# EAGLE design InverterControl_RevA (EAGLE 7.6.0)

## Sheet 1 of 3
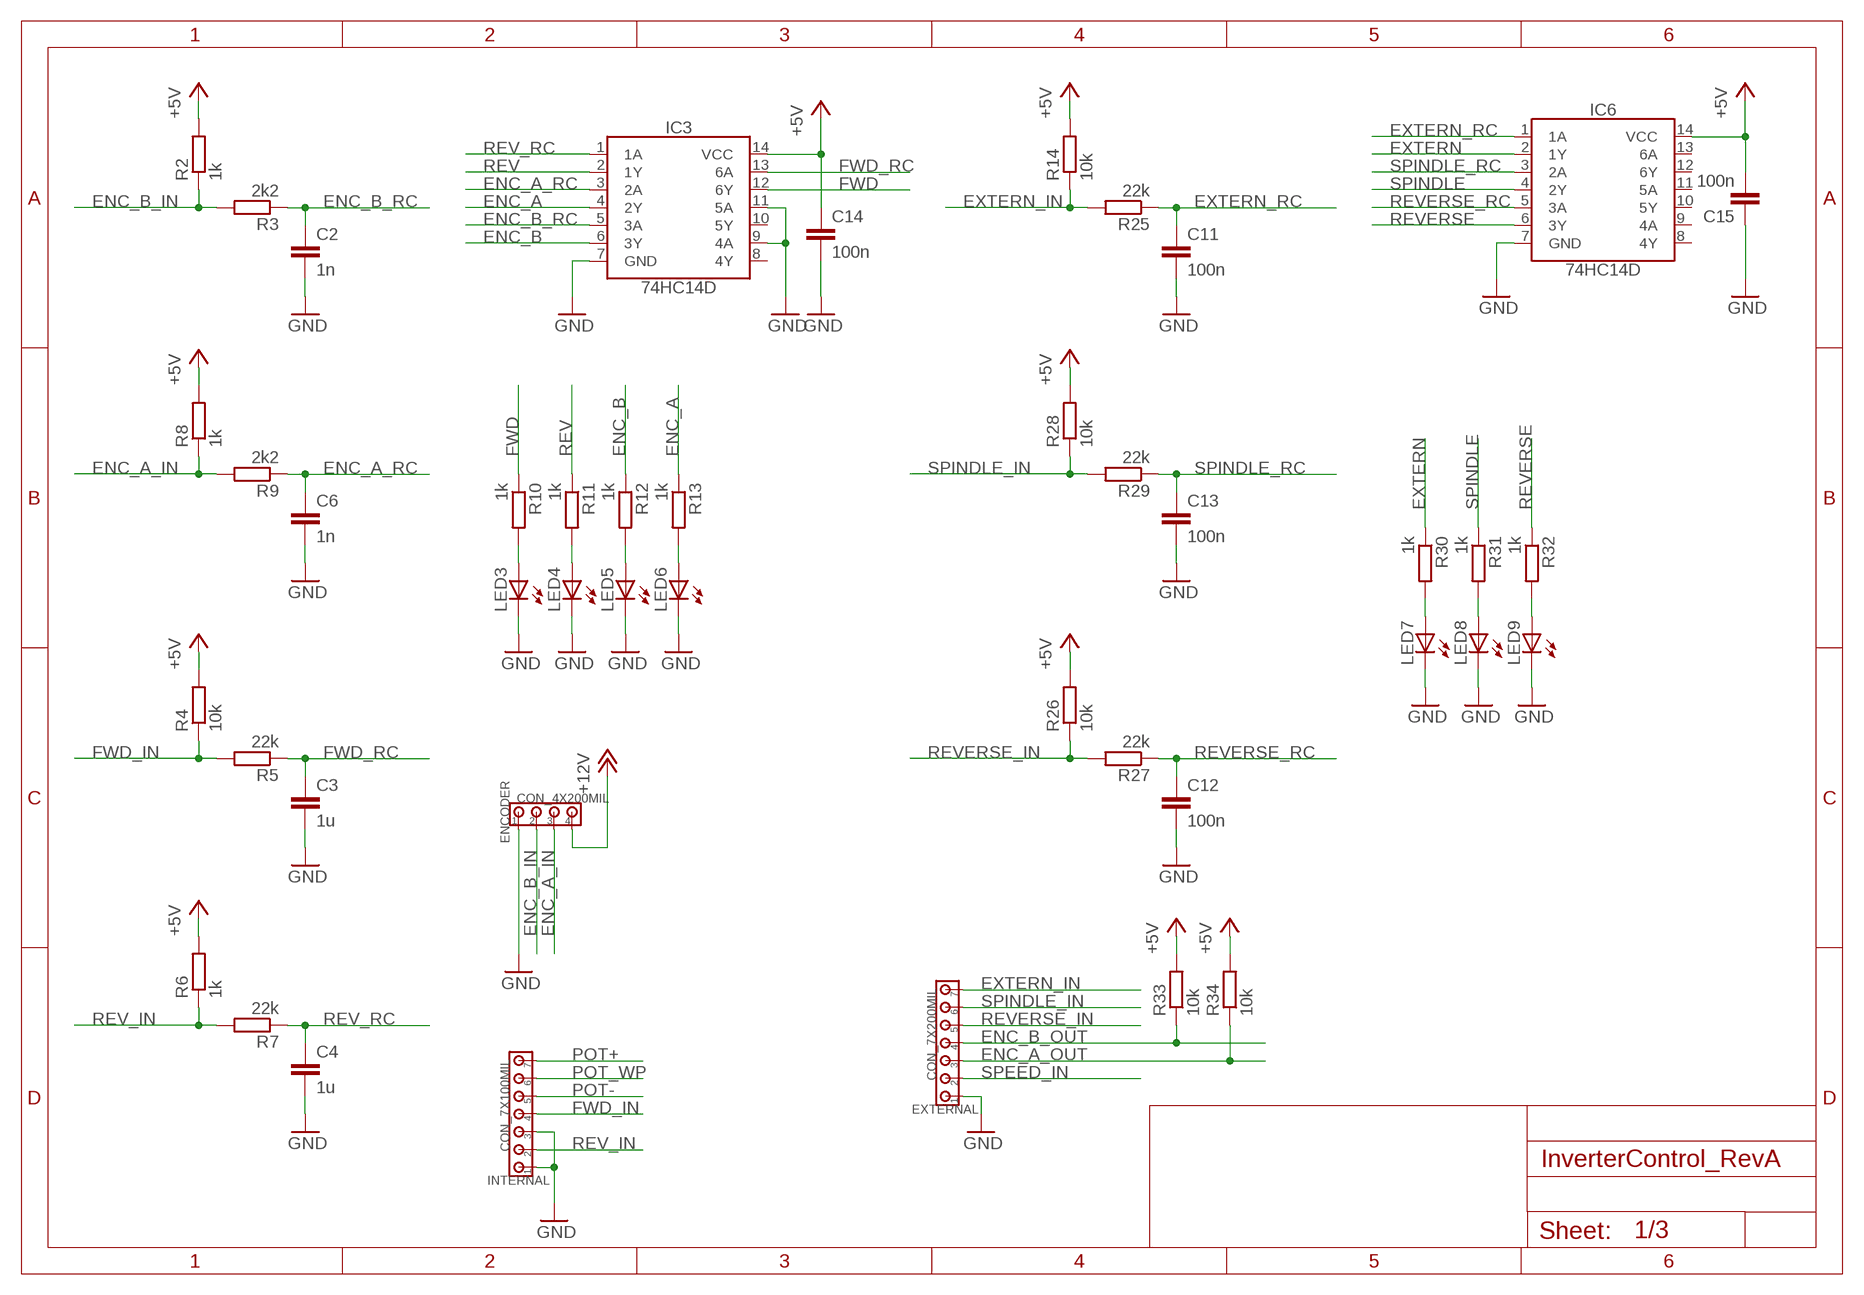
[diagram p0: schematic, sheet 1]

### Parts
C2  1n  CC0805  [C0805]
C3  1u  CC0805  [C0805]
C4  1u  CC0805  [C0805]
C6  1n  CC0805  [C0805]
C11  100n  CC0805  [C0805]
C12  100n  CC0805  [C0805]
C13  100n  CC0805  [C0805]
C14  100n  CC0805  [C0805]
C15  100n  CC0805  [C0805]
ENCODER  CON_4X200MIL  [200MIL_4X]
EXTERNAL  CON_7X200MIL  [200MIL_7X]
IC3  74HC14D  [SO14]
IC6  74HC14D  [SO14]
INTERNAL  CON_7X100MIL  [100MIL_7X]
LED3  LED0805  [LED0805]
LED4  LED0805  [LED0805]
LED5  LED0805  [LED0805]
LED6  LED0805  [LED0805]
LED7  LED0805  [LED0805]
LED8  LED0805  [LED0805]
LED9  LED0805  [LED0805]
R2  1k  RESISTORR0805  [R0805]
R3  2k2  RESISTORR0805  [R0805]
R4  10k  RESISTORR0805  [R0805]
R5  22k  RESISTORR0805  [R0805]
R6  1k  RESISTORR0805  [R0805]
R7  22k  RESISTORR0805  [R0805]
R8  1k  RESISTORR0805  [R0805]
R9  2k2  RESISTORR0805  [R0805]
R10  1k  RESISTORR0805  [R0805]
R11  1k  RESISTORR0805  [R0805]
R12  1k  RESISTORR0805  [R0805]
R13  1k  RESISTORR0805  [R0805]
R14  10k  RESISTORR0805  [R0805]
R25  22k  RESISTORR0805  [R0805]
R26  10k  RESISTORR0805  [R0805]
R27  22k  RESISTORR0805  [R0805]
R28  10k  RESISTORR0805  [R0805]
R29  22k  RESISTORR0805  [R0805]
R30  1k  RESISTORR0805  [R0805]
R31  1k  RESISTORR0805  [R0805]
R32  1k  RESISTORR0805  [R0805]
R33  10k  RESISTORR0805  [R0805]
R34  10k  RESISTORR0805  [R0805]

### Nets
+5V [+5v]: C14.1 C15.2 IC3.14(VCC) IC6.14(VCC) R2.2 R4.2 R6.2 R8.2 R14.2 R26.2 R28.2 R33.2 R34.2 ; also sheet 2,3
+12V [12v]: ENCODER.4 ; also sheet 2,3
ENC_A: IC3.4(2Y) R13.1 ; also sheet 2,3
ENC_A_IN: ENCODER.3 R8.1 R9.2
ENC_A_OUT: EXTERNAL.3 R34.1 ; also sheet 2
ENC_A_RC: C6.1 IC3.3(2A) R9.1
ENC_B: IC3.6(3Y) R12.1 ; also sheet 2,3
ENC_B_IN: ENCODER.2 R2.1 R3.2
ENC_B_OUT: EXTERNAL.4 R33.1 ; also sheet 2
ENC_B_RC: C2.1 IC3.5(3A) R3.1
EXTERN: IC6.2(1Y) R30.1 ; also sheet 3
EXTERN_IN: EXTERNAL.7 R14.1 R25.2
EXTERN_RC: C11.1 IC6.1(1A) R25.1
FWD: IC3.12(6Y) R10.1 ; also sheet 3
FWD_IN: INTERNAL.4 R4.1 R5.2
FWD_RC: C3.1 IC3.13(6A) R5.1
GND: C2.2 C3.2 C4.2 C6.2 C11.2 C12.2 C13.2 C14.2 C15.1 ENCODER.1 EXTERNAL.1 IC3.7(GND) IC3.9(4A) IC3.11(5A) IC6.7(GND) INTERNAL.1 INTERNAL.3 LED3.C LED4.C LED5.C LED6.C LED7.C LED8.C LED9.C ; also sheet 2,3
N$1: LED3.A R10.2
N$2: LED4.A R11.2
N$3: LED5.A R12.2
N$4: LED7.A R30.2
N$7: LED6.A R13.2
N$24: LED8.A R31.2
N$25: LED9.A R32.2
POT+ [analog]: INTERNAL.7 ; also sheet 2
POT- [analog]: INTERNAL.5 ; also sheet 2
POT_WP [analog]: INTERNAL.6 ; also sheet 2
REV: IC3.2(1Y) R11.1 ; also sheet 3
REV_IN: INTERNAL.2 R6.1 R7.2
REV_RC: C4.1 IC3.1(1A) R7.1
REVERSE: IC6.6(3Y) R32.1 ; also sheet 3
REVERSE_IN: EXTERNAL.5 R26.1 R27.2
REVERSE_RC: C12.1 IC6.5(3A) R27.1
SPEED_IN: EXTERNAL.2 ; also sheet 2
SPINDLE: IC6.4(2Y) R31.1 ; also sheet 3
SPINDLE_IN: EXTERNAL.6 R28.1 R29.2
SPINDLE_RC: C13.1 IC6.3(2A) R29.1
Unconnected: IC3.8(4Y) IC3.10(5Y) IC6.8(4Y) IC6.9(4A) IC6.10(5Y) IC6.11(5A) IC6.12(6Y) IC6.13(6A)

## Sheet 2 of 3
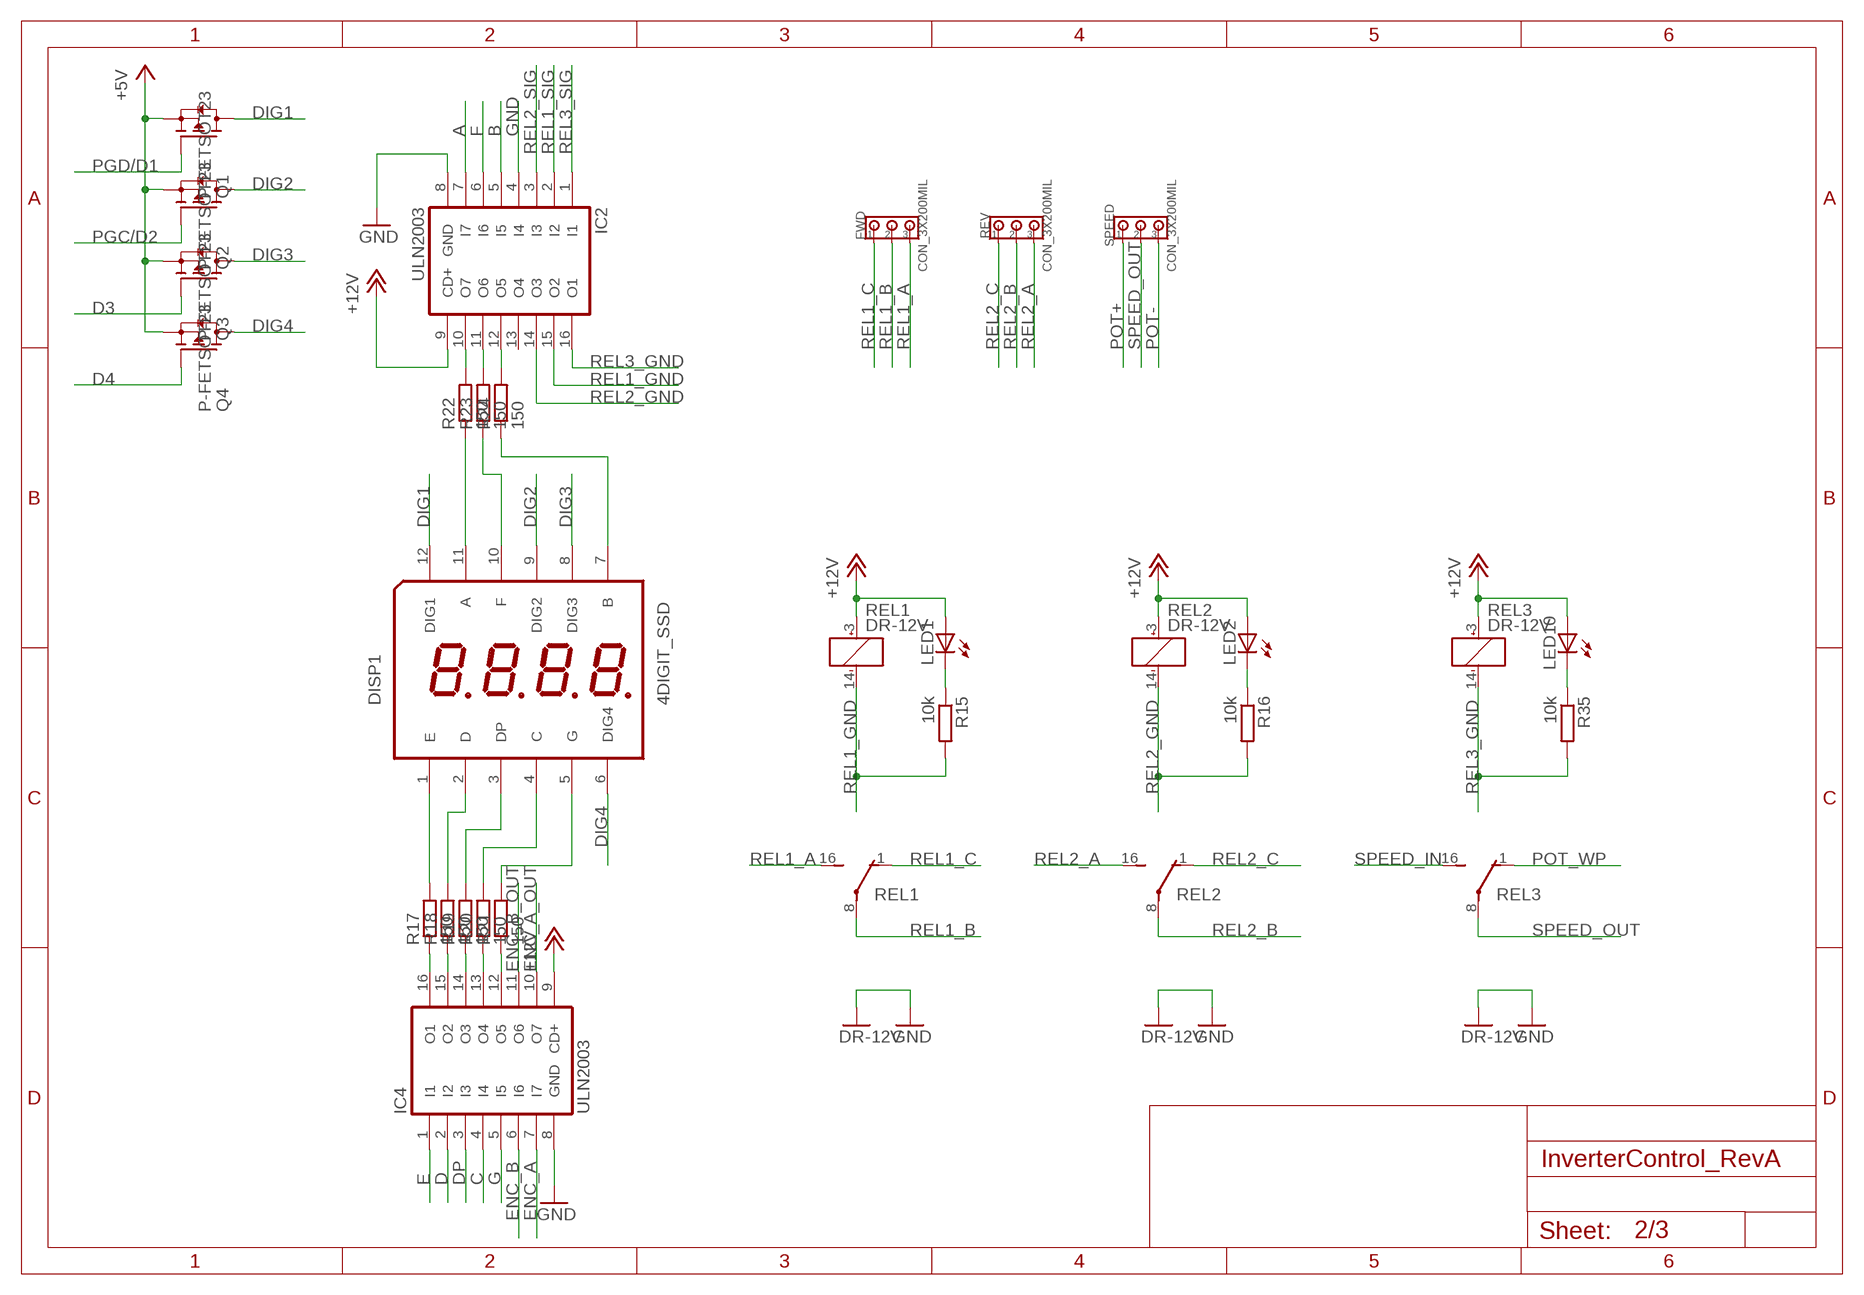
[diagram p1: schematic, sheet 2]

### Parts
DISP1  4DIGIT_SSD  [4DIGIT_SSD]
FWD  CON_3X200MIL  [200MIL_3X]
IC2  ULN2003  [SO16]
IC4  ULN2003  [SO16]
LED1  LED0805  [LED0805]
LED2  LED0805  [LED0805]
LED10  LED0805  [LED0805]
Q1  P-FETSOT23  [SOT23]
Q2  P-FETSOT23  [SOT23]
Q3  P-FETSOT23  [SOT23]
Q4  P-FETSOT23  [SOT23]
R15  10k  RESISTORR0805  [R0805]
R16  10k  RESISTORR0805  [R0805]
R17  150  RESISTORR0805  [R0805]
R18  150  RESISTORR0805  [R0805]
R19  150  RESISTORR0805  [R0805]
R20  150  RESISTORR0805  [R0805]
R21  150  RESISTORR0805  [R0805]
R22  150  RESISTORR0805  [R0805]
R23  150  RESISTORR0805  [R0805]
R24  150  RESISTORR0805  [R0805]
R35  10k  RESISTORR0805  [R0805]
REL1  DR-12V  [DR-12V]
REL2  DR-12V  [DR-12V]
REL3  DR-12V  [DR-12V]
REV  CON_3X200MIL  [200MIL_3X]
SPEED  CON_3X200MIL  [200MIL_3X]

### Nets
+5V [+5v]: Q1.2(S) Q2.2(S) Q3.2(S) Q4.2(S) ; also sheet 1,3
+12V [12v]: IC2.9(CD+) IC4.9(CD+) LED1.A LED2.A LED10.A REL1.3(+) REL2.3(+) REL3.3(+) ; also sheet 1,3
A: IC2.7(I7) ; also sheet 3
B: IC2.5(I5) ; also sheet 3
C: IC4.4(I4) ; also sheet 3
D: IC4.2(I2) ; also sheet 3
D3: Q3.1(G) ; also sheet 3
D4: Q4.1(G) ; also sheet 3
DIG1: DISP1.12(DIG1) Q1.3(D)
DIG2: DISP1.9(DIG2) Q2.3(D)
DIG3: DISP1.8(DIG3) Q3.3(D)
DIG4: DISP1.6(DIG4) Q4.3(D)
DP: IC4.3(I3) ; also sheet 3
E: IC4.1(I1) ; also sheet 3
ENC_A: IC4.7(I7) ; also sheet 1,3
ENC_A_OUT: IC4.10(O7) ; also sheet 1
ENC_B: IC4.6(I6) ; also sheet 1,3
ENC_B_OUT: IC4.11(O6) ; also sheet 1
F: IC2.6(I6) ; also sheet 3
G: IC4.5(I5) ; also sheet 3
GND: IC2.4(I4) IC2.8(GND) IC4.8(GND) REL1.9(GND) REL2.9(GND) REL3.9(GND) ; also sheet 1,3
N$5: DISP1.1(E) R17.2
N$6: DISP1.2(D) R18.2
N$8: LED1.C R15.1
N$9: LED2.C R16.1
N$10: DISP1.3(DP) R19.2
N$11: DISP1.4(C) R20.2
N$12: DISP1.5(G) R21.2
N$13: DISP1.11(A) R22.1
N$14: DISP1.10(F) R23.1
N$15: DISP1.7(B) R24.1
N$16: IC4.16(O1) R17.1
N$17: IC4.15(O2) R18.1
N$18: IC4.14(O3) R19.1
N$19: IC4.13(O4) R20.1
N$20: IC4.12(O5) R21.1
N$21: IC2.10(O7) R22.2
N$22: IC2.11(O6) R23.2
N$23: IC2.12(O5) R24.2
N$26: LED10.C R35.1
PGC/D2: Q2.1(G) ; also sheet 3
PGD/D1: Q1.1(G) ; also sheet 3
POT+ [analog]: SPEED.1 ; also sheet 1
POT- [analog]: SPEED.3 ; also sheet 1
POT_WP [analog]: REL3.1(NC) ; also sheet 1
REL1_A [relay]: FWD.3 REL1.16(NO)
REL1_B [relay]: FWD.2 REL1.8(COM)
REL1_C [relay]: FWD.1 REL1.1(NC)
REL1_GND: IC2.15(O2) R15.2 REL1.14(-)
REL1_SIG: IC2.2(I2) ; also sheet 3
REL2_A [relay]: REL2.16(NO) REV.3
REL2_B [relay]: REL2.8(COM) REV.2
REL2_C [relay]: REL2.1(NC) REV.1
REL2_GND: IC2.14(O3) R16.2 REL2.14(-)
REL2_SIG: IC2.3(I3) ; also sheet 3
REL3_GND: IC2.16(O1) R35.2 REL3.14(-)
REL3_SIG: IC2.1(I1) ; also sheet 3
SPEED_IN: REL3.16(NO) ; also sheet 1
SPEED_OUT [analog]: REL3.8(COM) SPEED.2
Unconnected: IC2.13(O4)

## Sheet 3 of 3
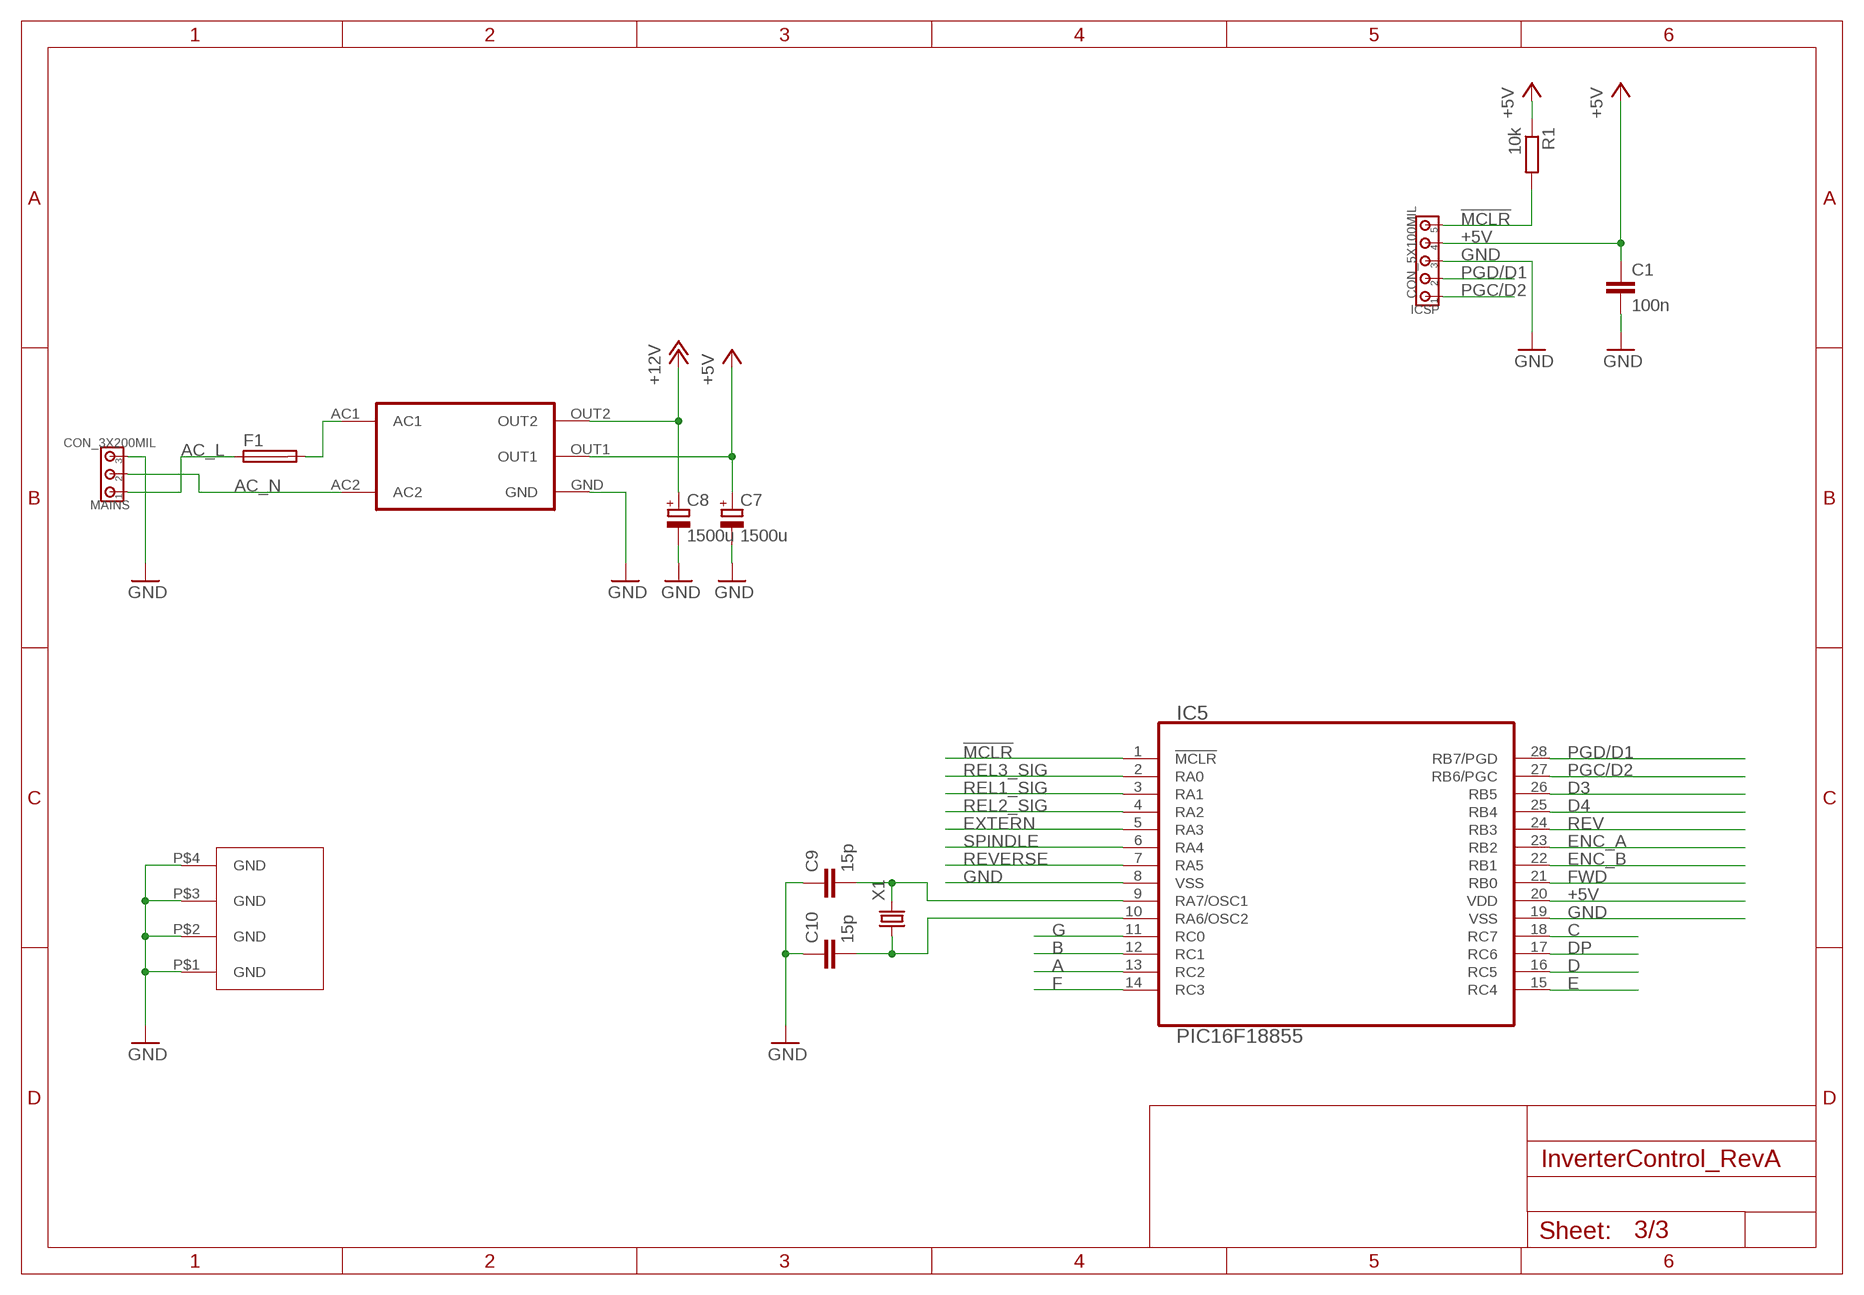
[diagram p2: schematic, sheet 3]

### Parts
ACDC1  MYRRA47246  [MYRRA47000]
C1  100n  CC0805  [C0805]
C7  1500u  C_POLARIZED10MM  [10MM]
C8  1500u  C_POLARIZED10MM  [10MM]
C9  15p  CC0805  [C0805]
C10  15p  CC0805  [C0805]
F1  SH22,5  [SH22,5]
IC5  PIC16F18855  [SO28W]
ICSP  CON_5X100MIL  [100MIL_5X]
MAINS  CON_3X200MIL  [200MIL_3X]
R1  10k  RESISTORR0805  [R0805]
U$1  PCB_SPEED_METER  [PBC_SPEED_METER]
X1  CRYSTAL5X3.2MM  [5X3.2MM]

### Nets
!MCLR!: IC5.1(!MCLR!) ICSP.5 R1.2
+5V [+5v]: ACDC1.OUT1 C1.1 C7.+ IC5.20(VDD) ICSP.4 R1.1 ; also sheet 1,2
+12V [12v]: ACDC1.OUT2 C8.+ ; also sheet 1,2
A: IC5.13(RC2) ; also sheet 2
AC_L [mains]: F1.1 MAINS.1
AC_N [mains]: ACDC1.AC2 MAINS.2
B: IC5.12(RC1) ; also sheet 2
C: IC5.18(RC7) ; also sheet 2
D: IC5.16(RC5) ; also sheet 2
D3: IC5.26(RB5) ; also sheet 2
D4: IC5.25(RB4) ; also sheet 2
DP: IC5.17(RC6) ; also sheet 2
E: IC5.15(RC4) ; also sheet 2
ENC_A: IC5.23(RB2) ; also sheet 1,2
ENC_B: IC5.22(RB1) ; also sheet 1,2
EXTERN: IC5.5(RA3) ; also sheet 1
F: IC5.14(RC3) ; also sheet 2
FWD: IC5.21(RB0) ; also sheet 1
G: IC5.11(RC0) ; also sheet 2
GND: ACDC1.GND C1.2 C7.- C8.- C9.1 C10.1 IC5.8(VSS) IC5.19(VSS) ICSP.3 MAINS.3 U$1.P$1(GND) U$1.P$2(GND) U$1.P$3(GND) U$1.P$4(GND) ; also sheet 1,2
N$29 [mains]: ACDC1.AC1 F1.2
N$32: C10.2 IC5.10(RA6/OSC2) X1.1
N$33: C9.2 IC5.9(RA7/OSC1) X1.2
PGC/D2: IC5.27(RB6/PGC) ICSP.1 ; also sheet 2
PGD/D1: IC5.28(RB7/PGD) ICSP.2 ; also sheet 2
REL1_SIG: IC5.3(RA1) ; also sheet 2
REL2_SIG: IC5.4(RA2) ; also sheet 2
REL3_SIG: IC5.2(RA0) ; also sheet 2
REV: IC5.24(RB3) ; also sheet 1
REVERSE: IC5.7(RA5) ; also sheet 1
SPINDLE: IC5.6(RA4) ; also sheet 1

## Library data of the parts
ACDC1 = 00ACDC:MYRRA47246
C1-C4 C6 C9-C15 = 00Capacitor:C: Capacitor
C7 C8 = 00Capacitor:C_POLARIZED
DISP1 = 00Display:4DIGIT_SSD: 4 digit 7-segment display
ENCODER = 00Connector:CON_4X: 4-pin header
EXTERNAL INTERNAL = 00Connector:CON_7X: 7-pin header
F1 = 00ACDC:SH22,5: FUSE HOLDER grid 22,5 mm, OGN0031 8201, Schurter (Buerklin); MF: SCHURTER; MPN: 0031.8201; OC_FARNELL: 1162740; OC_NEWARK: 96F8317
FWD MAINS REV SPEED = 00Connector:CON_3X: 3-pin header
IC2 IC4 = 00Transistor:ULN2003: Seven Darlington array
IC3 IC6 = 00Logic:74HC14: Hex Inverter Schmitt Trigger
IC5 = 00PIC:PIC16F18855
ICSP = 00Connector:CON_5X: 5-pin header
LED1-LED10 = 00Display:LED: LED
Q1-Q4 = 00Mosfet:P-FET
R1-R35 = 00Resistor:RESISTOR: RESISTOR, European symbol
REL1-REL3 = 00MyParts:DR-12V
U$1 = 00Drill:PCB_SPEED_METER
X1 = 00Crystal:CRYSTAL: Crystal

## Net classes
1 mains: width 0.813 mm, drill 0.6 mm, clearance 0.813 mm to class 0, clearance 0.813 mm
2 relay: width 0.813 mm, drill 0.6 mm, clearance 0.61 mm to class 0, clearance 0.61 mm to class 1
3 12v: width 0.61 mm, drill 0.6 mm, clearance 0.406 mm to class 0, clearance 0.406 mm to class 1, clearance 0.406 mm to class 2, clearance 0.406 mm
4 analog: width 0.406 mm, drill 0.6 mm, clearance 0.406 mm to class 0, clearance 0.406 mm to class 1, clearance 0.406 mm to class 2, clearance 0.406 mm to class 3, clearance 0.406 mm
5 +5v: width 0.61 mm, drill 0.6 mm, clearance 0.254 mm to class 0, clearance 0.254 mm to class 1, clearance 0.254 mm to class 2, clearance 0.254 mm to class 3, clearance 0.254 mm to class 4, clearance 0.254 mm

## Board
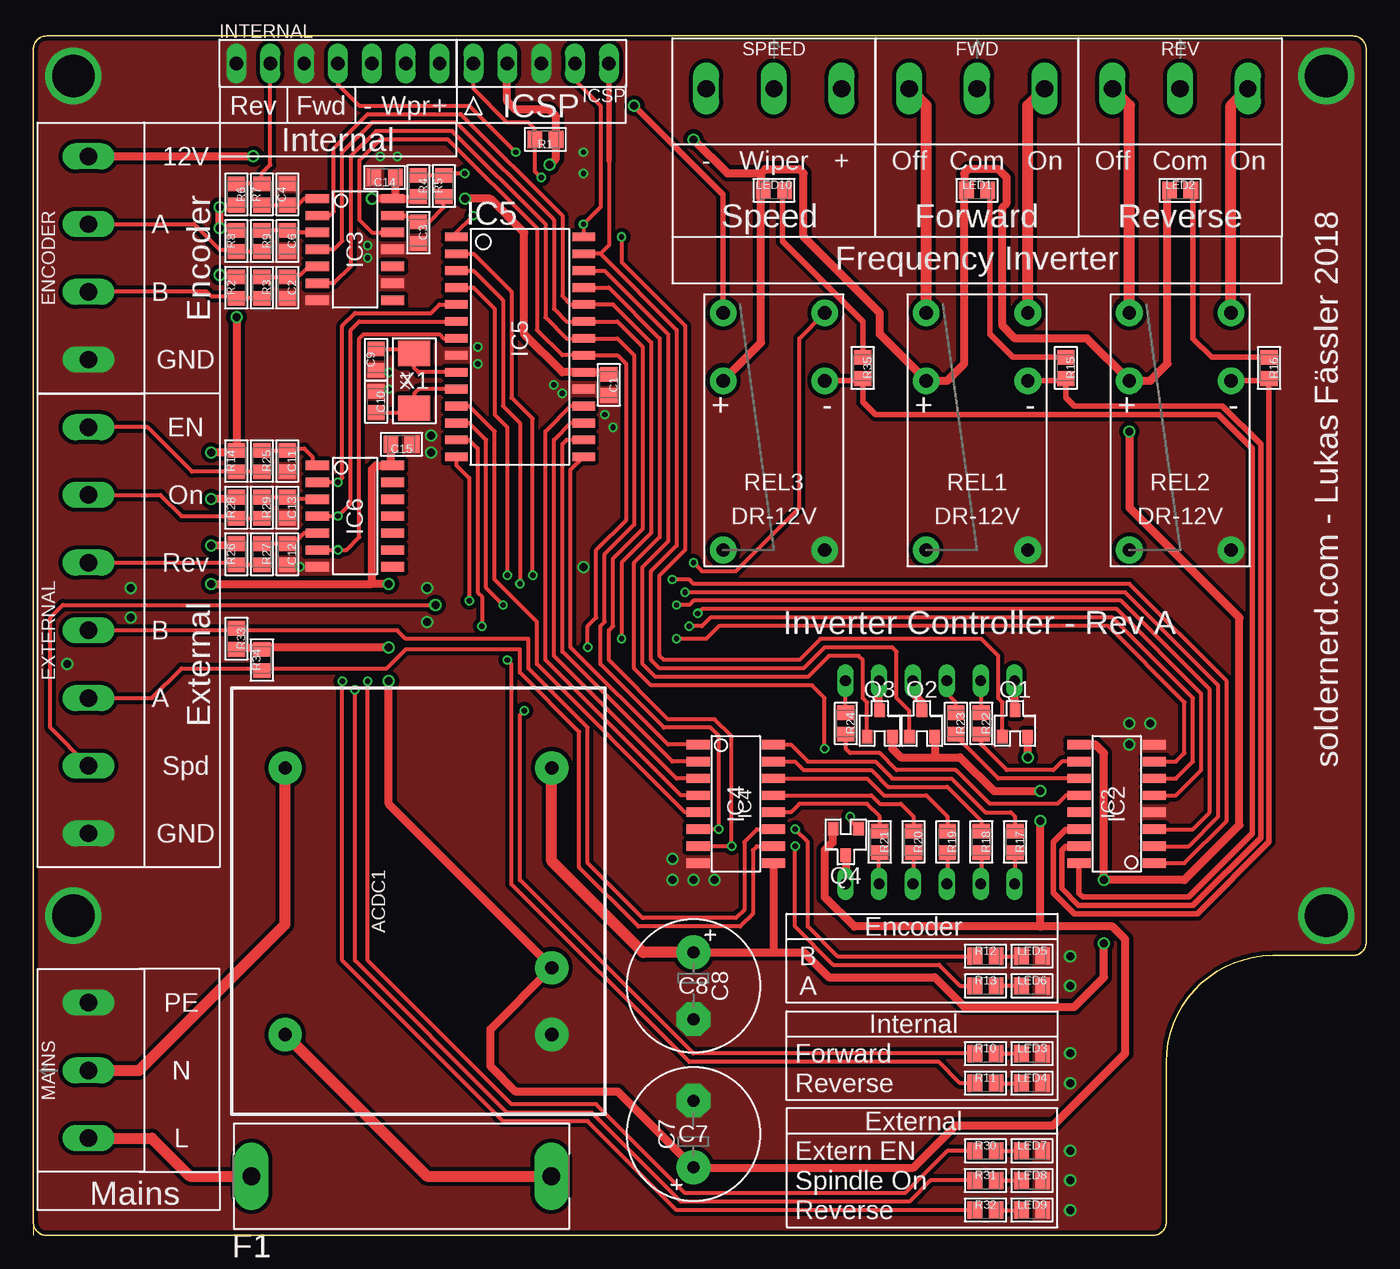
[diagram p3: board, top side]
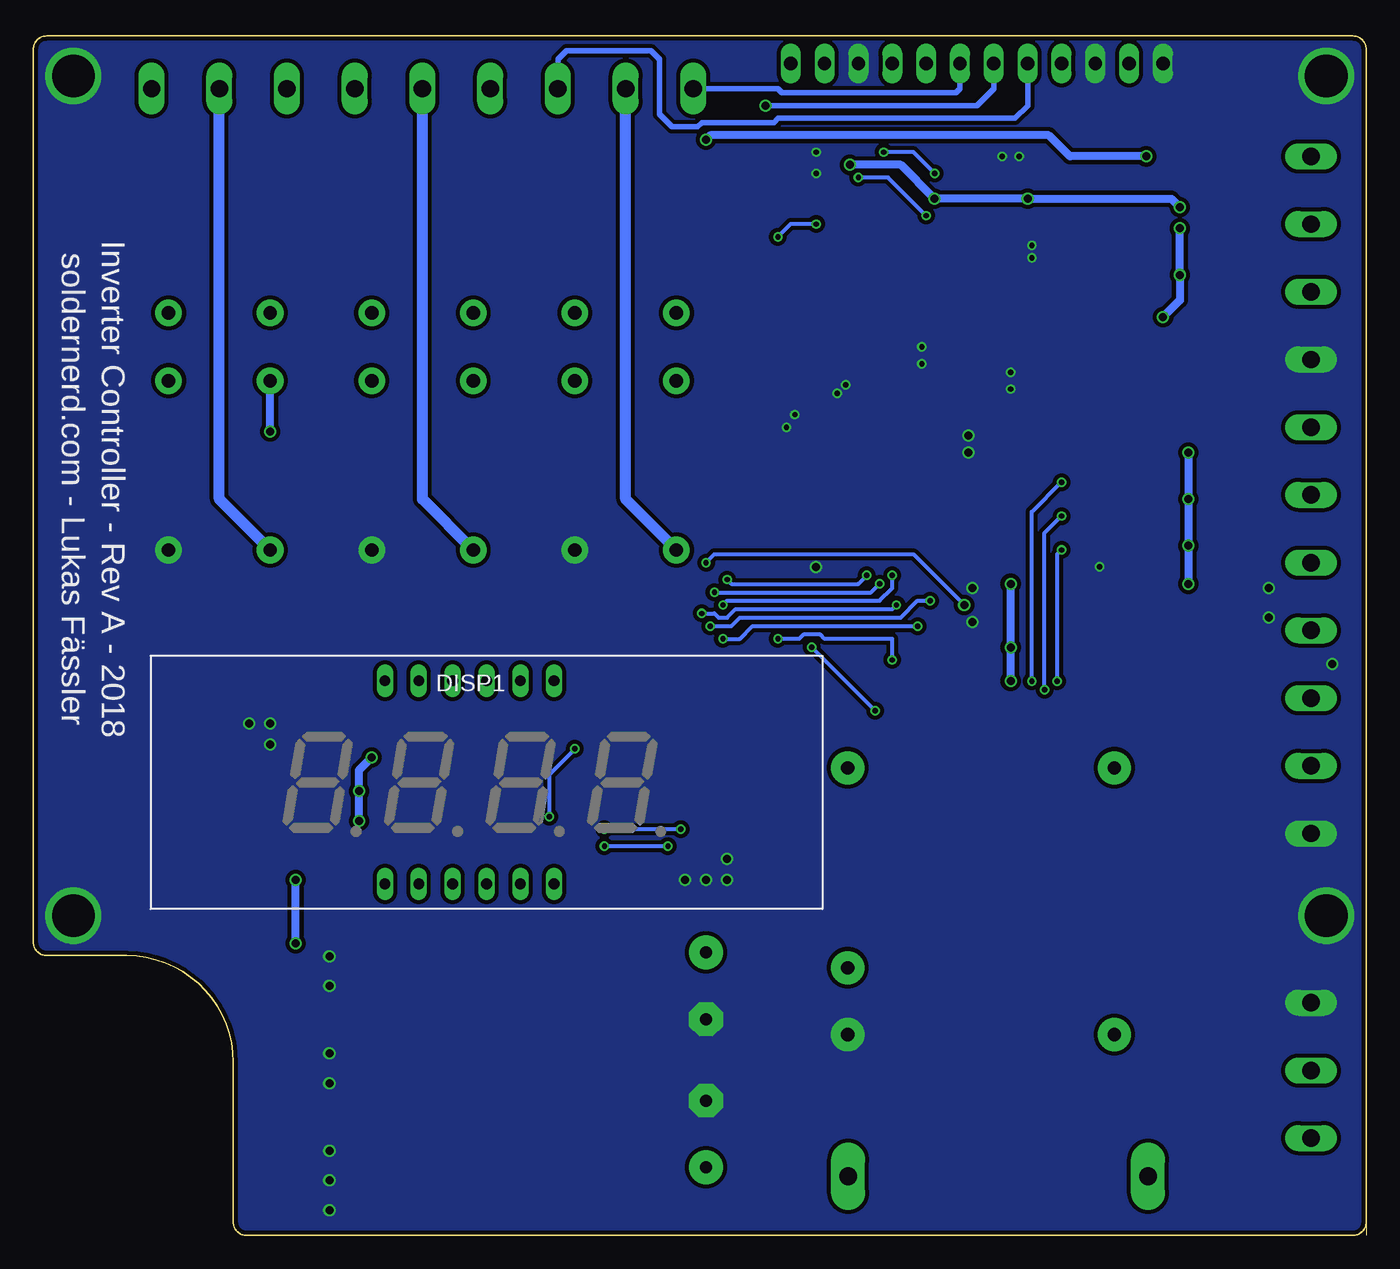
[diagram p4: board, bottom side, seen from below]

Size 100 x 90 mm. Coordinates in mm from the lower left corner, seen from the top.
Outline: 0,70 0,0
Copper layers (1*16): Top 0.035mm / dielectric 1.5mm / Bottom 0.035mm
Design rules "dirt_cheap_dirty_boards.8mil *": minimum track width 8mil, minimum drill 0.4mm, track to track 8mil, track to pad 8mil, pad to pad 8mil, via to via 8mil, smd to smd 0mil, copper to edge 10mil, drill to drill 10mil, minimum pad ring 8mil, minimum via ring 6mil, stop-mask expansion 2mil, vias tented up to drill 25mil, thermal gap 10mil

### Footprints (pad centres in the part's own frame; a part is rotated, then mirrored left to right if it is on the bottom)
MYRRA47000 = drill 1 pad 2.5: AC1 -10,10; AC2 10,10; GND -10,-10; OUT1 -5,-10; OUT2 10,-10
C0805 = smd 1.1 x 1.3: 1 -0.8,0; 2 0.8,0
10MM = drill 0.9 pad 2.54: + -2.5,0 | drill 0.9 pad 2.54 octagon: - 2.5,0
4DIGIT_SSD = drill 0.813 long: 1 -7.62,-7.62; 2 -5.08,-7.62; 3 -2.54,-7.62; 4 0,-7.62; 5 2.54,-7.62; 6 5.08,-7.62; 7 5.08,7.62; 8 2.54,7.62; 9 0,7.62; 10 -2.54,7.62; 11 -5.08,7.62; 12 -7.62,7.62
200MIL_4X = drill 1.3 long: 1 -7.62,0; 2 -2.54,0; 3 2.54,0; 4 7.62,0
200MIL_7X = drill 1.3 long: 1 -15.24,0; 2 -10.16,0; 3 -5.08,0; 4 0,0; 5 5.08,0; 6 10.16,0; 7 15.24,0
SH22,5 = drill 1.321 pad 2.54 long: 1 -11.252,0; 2 11.252,0
200MIL_3X = drill 1.3 long: 1 -5.08,0; 2 0,0; 3 5.08,0
SO16 = smd 0.7 x 1.75: 1 -4.445,-2.825; 2 -3.175,-2.825; 3 -1.905,-2.825; 4 -0.635,-2.825; 5 0.635,-2.825; 6 1.905,-2.825; 7 3.175,-2.825; 8 4.445,-2.825; 9 4.445,2.825; 10 3.175,2.825; 11 1.905,2.825; 12 0.635,2.825; 13 -0.635,2.825; 14 -1.905,2.825; 15 -3.175,2.825; 16 -4.445,2.825
SO14 = smd 0.7 x 1.75: 1 -3.81,-2.825; 2 -2.54,-2.825; 3 -1.27,-2.825; 4 0,-2.825; 5 1.27,-2.825; 6 2.54,-2.825; 7 3.81,-2.825; 8 3.81,2.825; 9 2.54,2.825; 10 1.27,2.825; 11 0,2.825; 12 -1.27,2.825; 13 -2.54,2.825; 14 -3.81,2.825
SO28W = smd 0.65 x 1.7: 1 -7.62,-4.78; 2 -6.35,-4.78; 3 -5.08,-4.78; 4 -3.81,-4.78; 5 -2.54,-4.78; 6 -1.27,-4.78; 7 0,-4.78; 8 1.27,-4.78; 9 2.54,-4.78; 10 3.81,-4.78; 11 5.08,-4.78; 12 6.35,-4.78; 13 7.62,-4.78; 14 8.89,-4.78; 15 8.89,4.78; 16 7.62,4.78; 17 6.35,4.78; 18 5.08,4.78; 19 3.81,4.78; 20 2.54,4.78; 21 1.27,4.78; 22 0,4.78; 23 -1.27,4.78; 24 -2.54,4.78; 25 -3.81,4.78; 26 -5.08,4.78; 27 -6.35,4.78; 28 -7.62,4.78
100MIL_5X = drill 1 long: 1 -5.08,0; 2 -2.54,0; 3 0,0; 4 2.54,0; 5 5.08,0
100MIL_7X = drill 1 long: 1 -7.62,0; 2 -5.08,0; 3 -2.54,0; 4 0,0; 5 2.54,0; 6 5.08,0; 7 7.62,0
LED0805 = smd 1.1 x 1.3: A -0.8,0; C 0.8,0
SOT23 = smd 0.8 x 1: 1 -0.95,-1; 2 0.95,-1; 3 0,1
R0805 = smd 1.1 x 1.3: 1 -0.8,0; 2 0.8,0
DR-12V = drill 1 pad 2: 1 -8.89,-3.81; 3 -3.81,-3.81; 8 8.89,-3.81; 9 8.89,3.81; 14 -3.81,3.81; 16 -8.89,3.81
PBC_SPEED_METER = drill 3.2: P$1 -31,-10; P$2 -31,53; P$3 63,53; P$4 63,-10
5X3.2MM = smd 1.9 x 2.4: 1 -2.05,0; 2 2.05,0

### Placement (x,y rotation side)
ACDC1  28.89,25.08 90 top
C1  43.18,63.82 270 top
C2  19.05,71.12 270 top
C3  28.89,75.25 270 top
C4  19.05,78.11 90 top
C6  19.05,74.61 270 top
C7  49.53,7.62 90 top
C8  49.53,18.73 270 top
C9  25.72,65.72 90 top
C10  25.72,62.55 270 top
C11  19.05,58.1 270 top
C12  19.05,51.12 270 top
C13  19.05,54.61 270 top
C14  26.35,79.38 180 top
C15  27.62,59.37 180 top
DISP1  66,34 0 bottom
ENCODER  4.13,73.34 90 top
EXTERNAL  4.13,45.4 90 top
F1  27.62,4.45 0 top
FWD  70.8,86.04 0 top
IC2  81.28,32.38 90 top
IC3  24.13,73.98 270 top
IC4  52.7,32.38 270 top
IC5  36.51,67.31 270 top
IC6  24.13,53.98 270 top
ICSP  38.1,87.95 180 top
INTERNAL  22.86,87.95 0 top
LED1  70.8,78.42 0 top
LED2  86.04,78.42 0 top
LED3  74.93,13.65 0 top
LED4  74.93,11.43 0 top
LED5  74.93,20.95 0 top
LED6  74.93,18.73 0 top
LED7  74.93,6.35 0 top
LED8  74.93,4.13 0 top
LED9  74.93,1.91 0 top
LED10  55.56,78.42 0 top
MAINS  4.13,12.38 90 top
Q1  73.66,38.42 0 top
Q2  66.67,38.42 0 top
Q3  63.5,38.42 0 top
Q4  60.96,29.53 180 top
R1  38.42,82.23 180 top
R2  15.24,71.12 90 top
R3  17.14,71.12 270 top
R4  28.89,78.74 270 top
R5  30.8,78.74 90 top
R6  15.24,78.11 270 top
R7  17.14,78.11 90 top
R8  15.24,74.61 90 top
R9  17.14,74.61 270 top
R10  71.44,13.65 0 top
R11  71.44,11.43 0 top
R12  71.44,20.95 0 top
R13  71.44,18.73 0 top
R14  15.24,58.1 90 top
R15  77.47,65.09 270 top
R16  92.71,65.09 270 top
R17  73.66,29.53 270 top
R18  71.12,29.53 270 top
R19  68.58,29.53 270 top
R20  66.04,29.53 270 top
R21  63.5,29.53 270 top
R22  71.12,38.42 270 top
R23  69.22,38.42 270 top
R24  60.96,38.42 270 top
R25  17.14,58.1 270 top
R26  15.24,51.12 90 top
R27  17.14,51.12 270 top
R28  15.24,54.61 90 top
R29  17.14,54.61 270 top
R30  71.44,6.35 0 top
R31  71.44,4.13 0 top
R32  71.44,1.91 0 top
R33  15.24,44.77 270 top
R34  17.14,43.18 90 top
R35  62.23,65.09 270 top
REL1  70.8,60.33 270 top
REL2  86.04,60.33 270 top
REL3  55.56,60.33 270 top
REV  86.04,86.04 0 top
SPEED  55.56,86.04 0 top
U$1  66,34 0 bottom
X1  28.57,64.14 90 top

### Tracks (layer width: path | path; a pad name or v marks a point on that pad's centre or on a via)
!MCLR!  (via drill 0.4)
  Top 0.305: ICSP.5 33.02,86.04 35.56,83.5 37.15,83.5 37.62,83.03 R1.2 37.62,79.86 v38.1,79.38 | IC5.1 31.73,75.23 v33.02,76.52
  Bottom 0.305: v33.02,76.52 35.88,79.38 v38.1,79.38
+5V  (via drill 0.6)
  Top 0.61: 75.56,23.18 80.96,23.18 81.92,22.23 81.92,13.65 76.52,8.26 69.22,8.26 66.04,5.08 49.53,5.08 C7.+ 43.85,10.79 36.2,10.79 34.29,12.7 34.29,15.48 ACDC1.OUT1 | 75.56,23.18 61.59,23.18 59.37,25.4 59.37,28.89 59.96,29.48 59.96,30.48 Q4.2 | 75.56,23.18 v75.56,31.11 | Q2.2 67.63,35.88 | Q3.2 64.45,36.51 65.09,35.88 67.63,35.88 | 38.89,20.16 26.67,32.38 v26.67,41.59 | v26.67,48.9 25.4,48.9 | 25.4,48.9 25.4,57.47 25.72,57.78 IC6.14 26.82,57.92 C15.2 | v13.34,58.74 15.07,58.74 R14.2 v15.24,68.9 | R28.2 15.07,55.24 v13.34,55.24 | R26.2 15.07,51.75 v13.34,51.75 | v13.34,48.9 25.4,48.9 | IC3.14 28.74,77.79 R4.2 | IC3.14 v25.4,77.79 | C1.1 43.33,64.77 IC5.20 39.69,64.77 36.83,67.63 36.83,75.25 34.29,77.79 v32.38,77.79 | ICSP.4 35.56,85.09 36.2,84.45 38.73,84.45 39.22,83.97 R1.1 39.22,80.81 v38.73,80.33 | 67.63,35.88 69.53,35.88 72.07,33.34 v75.56,33.34 | v74.61,35.88 Q1.2 | C14.1 27.15,77.98 IC3.14 | v26.67,44.13 17.3,44.13 R34.2 16.99,44.13 15.24,44.13 R33.2 | v13.97,72.07 15.09,72.07 R2.2 | R8.2 15.09,75.56 v13.97,75.56 v13.97,77.15 15.24,77.15 R6.2
  Top 0.813: Q2.2 | ACDC1.OUT1 38.89,20.16
  Bottom 0.61: v75.56,31.11 v75.56,33.34 75.56,34.92 v74.61,35.88 | v26.67,41.59 v26.67,44.13 v26.67,48.9 | v13.34,58.74 v13.34,55.24 v13.34,51.75 v13.34,48.9 | v13.97,77.15 14.61,77.79 v25.4,77.79 v32.38,77.79 34.92,80.33 v38.73,80.33 | v13.97,75.56 v13.97,72.07 13.97,70.17 v15.24,68.9
+12V  (via drill 0.6)
  Top 0.61: v82.23,60.33 82.23,54.61 90.49,46.35 90.49,30.8 86.36,26.67 v80.33,26.67 80.33,36.2 79.69,36.83 IC2.9 | ENCODER.4 v16.51,80.96 | v49.53,82.23 52.07,79.69 54.61,79.69 | C8.+ 55.56,21.23 | 55.56,21.23 57.83,21.23 59.69,19.37 67.63,19.37 69.85,17.14 78.11,17.14 80.33,19.37 v80.33,21.91 | IC4.9 55.53,21.27 55.56,21.23 | LED2.A 85.09,78.42 85.09,65.41 83.82,64.14 REL2.3 79.06,67.31 73.66,67.31 72.71,68.26 72.71,77.15 73.03,77.47 73.03,79.38 72.39,80.01 70.17,80.01 69.85,79.69 69.85,78.58 LED1.A 69.85,78.27 69.85,65.41 68.58,64.14 REL1.3 63.5,67.63 63.5,69.22 57.78,74.93 57.78,79.69 57.47,80.01 54.93,80.01 54.61,79.69 | REL3.3 54.61,66.99 54.61,78.42 | 54.61,79.69 54.61,78.42 | 54.61,78.42 LED10.A
  Top 0.813: C8.+ 45.76,21.23 38.89,28.1 ACDC1.OUT2
  Bottom 0.61: v82.23,60.33 REL2.3 | v16.51,80.96 22.23,80.96 23.81,82.55 49.21,82.55 v49.53,82.23 | v80.33,21.91 v80.33,26.67
A  (via drill 0.4)
  Top 0.305: IC2.7 85.72,35.56 86.36,36.2 86.36,40.01 80.64,45.72 51.44,45.72 50.48,44.77 v48.26,44.77 | IC5.13 32.7,59.69 33.34,59.05 33.34,48.26 33.66,47.94 v33.66,45.72
  Bottom 0.305: v48.26,44.77 46.99,44.77 46.04,45.72 v33.66,45.72
AC_L
  Top 0.813: MAINS.1 8.89,7.3 11.75,4.45 F1.1
AC_N
  Top 0.813: MAINS.2 7.94,12.38 18.89,23.34 ACDC1.AC2
B  (via drill 0.4)
  Top 0.305: IC2.5 85.72,33.02 87.63,34.92 87.63,40.64 81.28,46.99 50.16,46.99 v49.85,46.67 | IC5.12 32.7,60.96 33.97,59.69 33.97,48.58 v35.24,47.31
  Bottom 0.305: v49.85,46.67 48.9,46.67 48.58,46.35 47.94,46.35 47.31,46.99 35.56,46.99 v35.24,47.31
C
  Top 0.305: IC4.4 48.58,33.02 38.42,43.18 38.42,60.33 40.32,62.23 IC5.18
D
  Top 0.305: IC4.2 47.94,35.56 39.69,43.81 39.69,59.37 40.01,59.69 IC5.16
D3
  Top 0.305: Q3.1 62.55,40 62.23,40.32 62.23,43.18 61.91,43.5 59.69,43.5 58.1,41.91 46.67,41.91 45.72,42.86 45.72,50.16 47.62,52.07 47.62,67.63 42.86,72.39 IC5.26
D4  (via drill 0.4)
  Top 0.305: IC5.25 43.18,71.12 46.99,67.31 46.99,52.39 45.09,50.48 45.09,42.55 46.35,41.27 58.42,41.27 59.37,40.32 v59.37,36.51 | Q4.1 61.28,31.16 v61.28,31.43
  Bottom 0.305: v61.28,31.43 61.28,34.61 v59.37,36.51
DIG1
  Top 0.61: Q1.3 73.66,41.58 DISP1.12
DIG2
  Top 0.61: Q2.3 66.67,40.01 66.04,40.64 66.04,41.58 DISP1.9
DIG3
  Top 0.406: Q3.3 63.46,39.42
  Top 0.61: 63.46,39.42 DISP1.8
DIG4
  Top 0.305: 60.96,26.42 DISP1.6
  Top 0.61: Q4.3 60.96,26.42
DP
  Top 0.305: IC4.3 48.26,34.29 39.05,43.5 39.05,59.69 40.32,60.96 IC5.17
E
  Top 0.305: IC4.1 47.62,36.83 40.32,44.13 40.32,57.47 41.27,58.42 IC5.15
ENC_A  (via drill 0.4, 0.4 pad 0.4)
  Top 0.305: IC3.4 22.54,73.98 23.18,74.61 23.18,81.28 25.4,83.5 31.75,83.5 39.05,76.2 39.05,69.53 40.01,68.58 IC5.23 43.81,68.58 45.72,66.67 45.72,53.02 43.5,50.8 43.5,45.72 43.18,45.4 43.18,43.18 47.62,38.73 51.12,38.73 52.39,37.47 v52.39,29.21 IC4.7 | R13.1 69.53,18.73 67.94,20.32 60.01,20.32 57.15,23.18 v57.15,29.21
  Bottom 0.305: v52.39,29.21 v57.15,29.21
ENC_A_IN
  Top 0.305: R9.2 R8.1 15.07,73.98 13.97,73.98 12.06,75.88 ENCODER.3
ENC_A_OUT
  Top 0.305: EXTERNAL.3 8.89,40.32 11.11,42.55 17.14,42.55 | 17.14,42.55 17.31,42.55 | 17.31,42.55 R34.1 17.14,42.55 | IC4.10 54.29,29.21 53.98,28.89 53.98,24.13 53.02,23.18 45.4,23.18 40.96,27.62 40.96,37.78 36.51,42.23 36.51,43.97 27.94,43.97 26.52,42.55 17.31,42.55
ENC_A_RC
  Top 0.305: R9.1 C6.1 19.21,75.41 19.21,75.25 IC3.3
ENC_B  (via drill 0.4 pad 0.4)
  Top 0.305: IC3.6 22.54,71.44 23.81,72.71 23.81,80.96 25.72,82.87 31.43,82.87 38.42,75.88 38.42,68.9 40.01,67.31 IC5.22 43.81,67.31 45.09,66.04 45.09,53.34 42.86,51.12 42.86,46.04 42.55,45.72 42.55,42.86 47.31,38.1 50.8,38.1 51.44,37.47 v51.44,30.48 IC4.6 | R12.1 60.33,20.95 58.1,23.18 58.1,29.53 v57.15,30.48
  Bottom 0.305: v51.44,30.48 v57.15,30.48
ENC_B_IN
  Top 0.305: R3.2 R2.1 15.07,70.48 13.34,70.48 13.02,70.8 ENCODER.2
ENC_B_OUT
  Top 0.305: 15.24,45.4 27.3,45.4 27.94,44.77 37.15,44.77 37.15,42.55 41.59,38.1 41.59,27.94 45.72,23.81 52.7,23.81 53.34,24.45 53.34,29.53 54.29,30.48 IC4.11 | 15.24,45.4 EXTERNAL.4 | R33.1 15.24,45.4
ENC_B_RC
  Top 0.305: R3.1 C2.1 19.2,71.92 19.2,72.07 20,72.07 20.64,72.71 IC3.5
EXTERN  (via drill 0.4)
  Top 0.305: IC6.2 v22.86,56.52 23.18,56.83 23.18,68.26 24.13,69.22 29.84,69.22 30.48,69.85 IC5.5 | R30.1 68.58,6.35 65.41,3.17 48.9,3.17 42.23,9.84 35.88,9.84 25.08,20.64 v25.08,41.59
  Bottom 0.305: v25.08,41.59 25.08,54.29 v22.86,56.52
EXTERN_IN
  Top 0.305: R25.2 R14.1 11.91,57.3 8.57,60.64 EXTERNAL.7
EXTERN_RC
  Top 0.305: R25.1 C11.1 19.2,59.05 20.32,59.05 20.95,58.42 20.95,58.13 IC6.1
F  (via drill 0.4)
  Top 0.305: IC2.6 85.72,34.29 87,35.56 87,40.32 80.96,46.35 50.8,46.35 50.16,45.72 v49.21,45.72 | IC5.14 31.73,57.8 32.7,56.83 v32.7,47.62
  Bottom 0.305: v49.21,45.72 47.62,45.72 46.99,46.35 34.92,46.35 33.66,47.62 v32.7,47.62
FWD  (via drill 0.4)
  Top 0.305: R10.1 49.53,13.65 36.51,26.67 36.51,39.05 v36.83,39.37 | IC3.12 25.4,75.25 24.45,76.2 24.45,80.64 26.04,82.23 31.11,82.23 37.78,75.56 37.78,67.94 39.69,66.04 IC5.21 43.81,66.04 44.45,65.41 44.45,53.66 42.23,51.44 42.23,46.35 41.59,45.72 v41.59,44.13
  Bottom 0.305: v36.83,39.37 v41.59,44.13
FWD_IN  (via drill 0.4)
  Top 0.305: R4.1 R5.2 30.95,79.69 v32.38,79.69 | INTERNAL.4 22.86,86.36 24.45,84.77 32.7,84.77 v36.2,81.28
  Bottom 0.305: v32.38,79.69 33.97,81.28 v36.2,81.28
FWD_RC
  Top 0.305: IC3.13 27.94,76.52 28.26,76.2 28.74,76.2 C3.1 29.69,76.05 30.8,77.15 R5.1
G
  Top 0.305: IC4.5 48.9,31.75 37.78,42.86 37.78,46.04 34.61,49.21 34.61,60.33 32.7,62.23 IC5.11
GND  (via drill 0.4, 0.6)
  other vias: 20,50.16 26.67,63.5 26.67,64.77 33.34,66.67 33.34,65.41 42.86,61.59 43.5,60.64 26.04,80.96 27.3,80.96 25.08,74.3 25.08,73.34 39.05,63.82 39.69,63.18 29.84,60.01 29.84,58.74 41.27,81.28 41.27,79.69 77.79,20.95 77.79,18.73 77.79,13.65 77.79,11.43 77.79,6.35 77.79,4.13 77.79,1.91 83.82,38.42 82.23,36.83 82.23,38.42 47.94,28.26 47.94,26.67 49.53,26.67 51.12,26.67 7.3,48.58 29.53,48.58 2.54,42.86 29.53,46.04 41.27,50.16 7.3,46.35
  pour Bottom (isolate 0.305, no thermals): 0,63 0,89 arc-90 1,90 9,90 99,90 arc-90 100,89 100,75 100,22 arc-90 99,21 93,21 arc90 85,13 85,6 85,1 arc-90 84,0 78,0 1,0 arc-90 0,1 0,4
  pour Top (isolate 0.305, no thermals): 0,63 0,89 arc-90 1,90 11,90 99,90 arc-90 100,89 100,76 100,22 arc-90 99,21 97,21 93,21 arc90 85,13 85,6 85,1 arc-90 84,0 81,0 1,0 arc-90 0,1 0,4
N$1
  Top 0.305: R10.2 LED3.A
N$2
  Top 0.305: R11.2 LED4.A
N$3
  Top 0.305: R12.2 LED5.A
N$4
  Top 0.305: R30.2 LED7.A
N$5
  Top 0.305: R17.2 73.66,26.42 DISP1.1
N$6
  Top 0.305: R18.2 71.12,26.42 DISP1.2
N$7
  Top 0.305: LED6.A R13.2
N$8
  Top 0.305: 71.75,78.27 LED1.C
  Top 0.406: R15.1 73.5,65.89 71.75,67.63 71.75,78.27
N$9
  Top 0.305: 87,78.27 LED2.C
  Top 0.406: R16.1 88.42,65.89 87,67.31 87,78.27
N$10
  Top 0.305: R19.2 68.58,26.42 DISP1.3
N$11
  Top 0.305: R20.2 66.04,26.42 DISP1.4
N$12
  Top 0.305: DISP1.5 63.46,28.69
  Top 0.406: 63.46,28.69 R21.2
N$13
  Top 0.305: R22.1 71.12,41.58 DISP1.11
N$14
  Top 0.305: R23.1 69.22,40.01 68.58,40.64 68.58,41.58 DISP1.10
N$15
  Top 0.305: 60.92,39.22 DISP1.7
  Top 0.406: R24.1 60.92,39.22
N$16
  Top 0.305: IC4.16 56.83,36.83 58.1,35.56 63.18,35.56 64.45,34.29 68.9,34.29 71.44,31.75 73.34,31.75 73.66,31.43 R17.1
N$17
  Top 0.305: IC4.15 57.15,35.56 57.78,34.92 62.87,34.92 64.14,33.66 68.58,33.66 71.12,31.11 R18.1
N$18
  Top 0.305: IC4.14 62.55,34.29 63.82,33.02 66.99,33.02 68.58,31.43 R19.1
N$19
  Top 0.305: IC4.13 62.87,33.02 63.5,32.38 65.09,32.38 66.04,31.43 R20.1
N$20
  Top 0.305: R21.1 63.5,31.43 62.55,32.38 57.47,32.38 56.83,31.75 IC4.12
N$21
  Top 0.305: IC2.10 77.15,35.56 76.52,34.92 73.03,34.92 71.12,36.83 R22.2
N$22
  Top 0.305: IC2.11 72.39,34.29 69.22,37.47 R23.2
N$23
  Top 0.305: IC2.12 77.47,33.02 76.83,32.38 71.75,32.38 69.22,34.92 64.77,34.92 63.5,36.2 61.28,36.2 60.96,36.51 R24.2
N$24
  Top 0.305: R31.2 LED8.A
N$25
  Top 0.305: R32.2 LED9.A
N$26
  Top 0.305: 56.52,78.27 LED10.C
  Top 0.406: R35.1 62.23,68.58 56.2,74.61 56.2,78.42 LED10.C
N$29
  Top 0.813: ACDC1.AC1 29.53,4.45 F1.2
N$32
  Top 0.305: IC5.10 28.89,63.5 28.57,63.18 X1.1 28.24,61.75 C10.2
N$33
  Top 0.305: IC5.9 28.89,64.77 28.57,65.09 X1.2 28.24,66.52 C9.2
PGC/D2
  Top 0.305: Q2.1 65.72,39.37 64.77,40.32 64.77,43.81 64.45,44.13 59.37,44.13 57.78,42.55 46.99,42.55 46.35,43.18 46.35,49.85 48.26,51.75 48.26,67.94 42.55,73.66 | 43.18,80.64 43.18,74.3 42.55,73.66 | 42.55,73.66 IC5.27
  Top 0.406: 43.18,80.64 ICSP.1
PGD/D1  (via drill 0.4)
  Top 0.305: Q1.1 72.71,40 72.39,40.32 72.39,43.5 71.12,44.77 59.05,44.77 57.47,43.18 47.31,43.18 46.99,43.5 46.99,49.53 48.9,51.44 48.9,68.26 44.13,73.03 v44.13,74.93 | IC5.28 41.27,74.95 v41.27,75.88 42.55,77.15 42.55,84.77 40.64,86.68 ICSP.2
  Bottom 0.305: v41.27,75.88 43.18,75.88 v44.13,74.93
POT+
  Bottom 0.406: INTERNAL.7 30.48,86.04 30.8,85.72 43.81,85.72 44.13,86.04 SPEED.1
POT-
  Bottom 0.406: INTERNAL.5 25.4,84.77 26.35,83.82 44.13,83.82 44.45,83.5 49.85,83.5 50.16,83.19 52.07,83.19 53.02,84.14 53.02,88.27 53.66,88.9 60.01,88.9 60.64,88.27 SPEED.3
POT_WP  (via drill 0.6)
  Top 0.406: v45.09,84.77 51.75,78.11 REL3.1
  Bottom 0.406: INTERNAL.6 27.94,86.04 29.21,84.77 v45.09,84.77
REL1_A
  Top 0.813: REL1.16 74.61,84.77 FWD.3
REL1_B
  Bottom 0.813: REL1.8 70.8,55.24 FWD.2
REL1_C
  Top 0.813: REL1.1 66.99,84.77 FWD.1
REL1_GND
  Top 0.305: IC2.15 77.47,29.21 | 77.32,64.14 R15.2
  Top 0.406: 77.47,29.21 77.15,28.89 77.15,26.04 78.42,24.77 87,24.77 92.08,29.84 92.08,59.37 89.22,62.23 78.11,62.23 77.47,62.87 R15.2 | REL1.14 77.32,64.14
REL1_SIG  (via drill 0.4)
  Top 0.305: IC2.2 86.68,29.21 88.9,31.43 88.9,41.27 81.92,48.26 v48.9,48.26 | IC5.3 33.02,72.39 35.24,70.17 35.24,62.23 36.51,60.96 v36.51,48.9
  Bottom 0.305: v48.9,48.26 37.15,48.26 v36.51,48.9
REL2_A
  Top 0.813: REL2.16 89.85,84.77 REV.3
REL2_B
  Bottom 0.813: REL2.8 86.04,55.24 REV.2
REL2_C
  Top 0.813: REL2.1 82.23,84.77 REV.1
REL2_GND
  Top 0.305: IC2.14 77.47,30.48 | 92.56,64.14 R16.2 92.71,64.14
  Top 0.406: 77.47,30.48 76.52,29.53 76.52,25.72 78.11,24.13 87.31,24.13 92.71,29.53 R16.2 | REL2.14 92.71,64.14
REL2_SIG  (via drill 0.4)
  Top 0.305: IC2.3 87,30.48 88.27,31.75 88.27,40.96 81.6,47.62 49.53,47.62 49.21,47.31 v48.26,47.31 | IC5.4 33.02,71.12 34.61,69.53 34.61,61.59 35.56,60.64 v35.56,49.53
  Bottom 0.305: v48.26,47.31 47.94,47.62 36.51,47.62 35.56,48.58 v35.56,49.53
REL3_GND
  Top 0.305: 62.08,64.14 R35.2
  Top 0.406: IC2.16 78.45,25.68 78.74,25.4 86.68,25.4 91.44,30.16 91.44,59.05 88.9,61.59 63.18,61.59 62.23,62.55 R35.2 | REL3.14 62.08,64.14
REL3_SIG  (via drill 0.4)
  Top 0.305: IC2.1 86.36,27.94 89.53,31.11 89.53,41.59 82.23,48.9 49.53,48.9 49.21,49.21 v47.94,49.21 | IC5.2 33.02,73.66 35.88,70.8 35.88,62.87 37.47,61.28 v37.47,49.53
  Bottom 0.305: v47.94,49.21 47.62,48.9 38.1,48.9 v37.47,49.53
REV  (via drill 0.4)
  Top 0.305: R11.1 69.53,11.43 67.94,13.02 49.21,13.02 35.88,26.35 35.88,42.86 v35.56,43.18 | IC3.2 22.23,76.52 22.54,76.83 22.54,81.6 25.08,84.14 32.07,84.14 39.69,76.52 39.69,70.48 40.32,69.85 IC5.24 43.5,69.85 46.35,66.99 46.35,52.7 44.13,50.48 v44.13,44.77
  Bottom 0.305: v35.56,43.18 35.56,44.77 40.64,44.77 40.96,45.09 42.23,45.09 42.55,44.77 v44.13,44.77
REV_IN
  Top 0.305: R6.1 R7.2 17.14,79.69 17.78,80.33 INTERNAL.2
REV_RC
  Top 0.305: R7.1 C4.1 19.2,77.15 19.68,77.15 20.32,77.79 IC3.1
REVERSE  (via drill 0.4)
  Top 0.305: IC6.6 v22.86,51.44 23.5,51.44 24.45,52.39 24.45,67.31 24.77,67.63 30.48,67.63 30.8,67.31 IC5.7 | R32.1 48.26,1.91 41.59,8.57 35.24,8.57 23.18,20.64 v23.18,41.59
  Bottom 0.305: v23.18,41.59 23.18,51.12 v22.86,51.44
REVERSE_IN
  Top 0.305: R27.2 R26.1 15.07,50.48 EXTERNAL.5
REVERSE_RC
  Top 0.305: R27.1 C12.1 19.53,51.92 20.32,52.7 IC6.5
SPEED_IN  (via drill 0.4, 0.6)
  Top 0.305: EXTERNAL.2 1.27,38.1 1.27,46.35 2.22,47.31 v30.16,47.31 | REL3.16 57.47,67.31 57.47,54.61 52.7,49.85 50.16,49.85 v49.53,50.48
  Bottom 0.305: v49.53,50.48 48.9,51.12 33.97,51.12 v30.16,47.31
SPEED_OUT
  Bottom 0.813: REL3.8 55.56,55.24 SPEED.2
SPINDLE  (via drill 0.4)
  Top 0.305: IC6.4 v22.86,53.98 23.81,54.93 23.81,67.94 24.45,68.58 IC5.6 | R31.1 67.31,4.13 65.72,2.54 48.58,2.54 41.91,9.21 35.56,9.21 24.13,20.64 v24.13,40.96
  Bottom 0.305: v24.13,40.96 24.13,52.7 v22.86,53.98
SPINDLE_IN
  Top 0.305: R29.2 R28.1 15.07,53.98 11.11,53.98 9.53,55.56 EXTERNAL.6
SPINDLE_RC
  Top 0.305: R29.1 C13.1 19.21,55.24 IC6.3

### Text on the board
tPlace: Rev | Fwd | - | Wpr | + | ICSP | Internal | 12V | - | Wiper | + | Off | Com | On | Off | Com | On | Speed | Forward | Reverse | A | Encoder | Frequency Inverter | B | GND | EN | On | soldernerd.com - Lukas Fässler 2018 | Rev | Inverter Controller - Rev A | B | External | A | Spd | GND | Encoder | B | A | PE | Internal | Forward | N | Reverse | External | L | Extern EN | Spindle On | Mains | Reverse
bPlace: Inverter Controller - Rev A - 2018 | soldernerd.com - Lukas Fässler